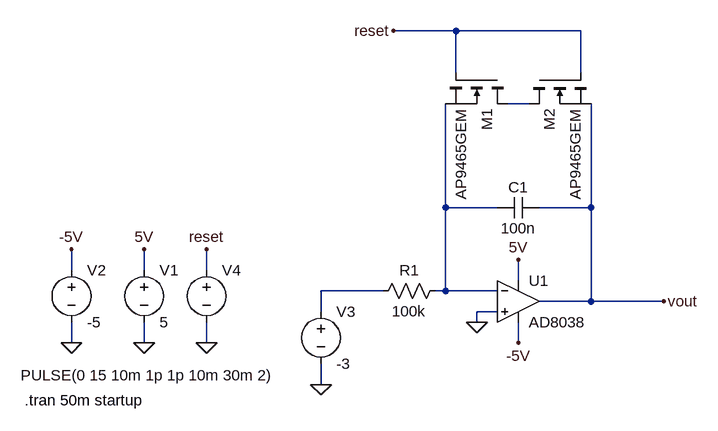
[diagram p0: schematic windup_reset.asc]
windup_reset.asc, the LTspice schematic file:
Version 4.1
SHEET 1 900 680
WIRE 512 -192 416 -192
WIRE 704 -192 512 -192
WIRE 512 -128 512 -192
WIRE 704 -128 704 -192
WIRE 624 -80 592 -80
WIRE 496 80 496 -80
WIRE 576 80 496 80
WIRE 720 80 720 -80
WIRE 720 80 640 80
WIRE -80 176 -80 144
WIRE 32 176 32 144
WIRE 128 176 128 144
WIRE 608 192 608 160
WIRE 400 208 304 208
WIRE 496 208 496 80
WIRE 496 208 480 208
WIRE 576 208 496 208
WIRE 720 224 720 80
WIRE 720 224 640 224
WIRE 832 224 720 224
WIRE 304 240 304 208
WIRE 576 240 544 240
WIRE 544 256 544 240
WIRE -80 288 -80 256
WIRE 32 288 32 256
WIRE 128 288 128 256
WIRE 608 288 608 256
WIRE 304 352 304 320
FLAG 32 288 0
FLAG 32 144 5V
FLAG 608 160 5V
FLAG 544 256 0
FLAG 608 288 -5V
FLAG -80 288 0
FLAG -80 144 -5V
FLAG 304 352 0
FLAG 832 224 vout
FLAG 128 288 0
FLAG 128 144 reset
FLAG 416 -192 reset
SYMBOL voltage 32 160 R0
WINDOW 123 0 0 Left 0
WINDOW 39 0 0 Left 0
SYMATTR InstName V1
SYMATTR Value 5
SYMBOL OpAmps\\AD8038 608 160 R0
SYMATTR InstName U1
SYMBOL cap 640 64 R90
WINDOW 0 0 32 VBottom 2
WINDOW 3 32 32 VTop 2
SYMATTR InstName C1
SYMATTR Value 100n
SYMBOL voltage -80 160 R0
WINDOW 123 0 0 Left 0
WINDOW 39 0 0 Left 0
SYMATTR InstName V2
SYMATTR Value -5
SYMBOL res 496 192 R90
WINDOW 0 0 56 VBottom 2
WINDOW 3 32 56 VTop 2
SYMATTR InstName R1
SYMATTR Value 100k
SYMBOL voltage 304 224 R0
WINDOW 123 0 0 Left 0
WINDOW 39 0 0 Left 0
SYMATTR InstName V3
SYMATTR Value -3
SYMBOL nmos 592 -128 R90
SYMATTR InstName M1
SYMATTR Value AP9465GEM
SYMBOL voltage 128 160 R0
WINDOW 3 -286 178 Left 2
WINDOW 123 0 0 Left 0
WINDOW 39 0 0 Left 0
SYMATTR InstName V4
SYMATTR Value PULSE(0 15 10m 1p 1p 10m 30m 2)
SYMBOL nmos 624 -128 M90
SYMATTR InstName M2
SYMATTR Value AP9465GEM
TEXT -152 376 Left 2 !.tran 50m startup

The netlist it stands for:
* windup_reset.asc
V1 5V 0 5
X§U1 0 N002 5V -5V vout AD8038  ; pins In+ In- V+ V- OUT
C1 vout N002 100n
V2 -5V 0 -5
R1 N002 N003 100k
V3 N003 0 -3
M1 N001 reset N002 N002 AP9465GEM
V4 reset 0 PULSE(0 15 10m 1p 1p 10m 30m 2)
M2 N001 reset vout vout AP9465GEM
.model NMOS NMOS
.model PMOS PMOS
.lib standard.mos
.tran 50m startup
.backanno
.end